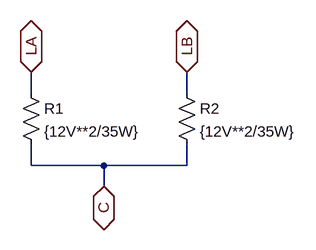
[diagram p0: schematic LampadaDupla.asc]
LampadaDupla.asc, the LTspice schematic file:
Version 4
SHEET 1 880 680
WIRE 128 112 128 80
WIRE 368 112 368 80
WIRE 128 224 128 192
WIRE 240 224 128 224
WIRE 368 224 368 192
WIRE 368 224 240 224
WIRE 240 256 240 224
FLAG 240 256 C
IOPIN 240 256 BiDir
FLAG 128 80 LA
IOPIN 128 80 BiDir
FLAG 368 80 LB
IOPIN 368 80 BiDir
SYMBOL res 112 96 R0
SYMATTR InstName R1
SYMATTR Value {12V**2/35W}
SYMBOL res 352 96 R0
SYMATTR InstName R2
SYMATTR Value {12V**2/35W}

The netlist it stands for:
* LampadaDupla.asc
R1 LA C {12V**2/35W}
R2 LB C {12V**2/35W}
.backanno
.end